# EasyEDA Pro project ProPrj_wifi-cam-car（立创eda专业版导入）.epro

# Schematic Schematic1
Board Name: Board1; Create Date: 2024-10-17; Page Name: P1; Project Name: wifi-cam-car; Schematic Name: Schematic1; Update Date: 2024-10-22; Company: 嘉立创EDA; Page Size: A3; Version: V1.0
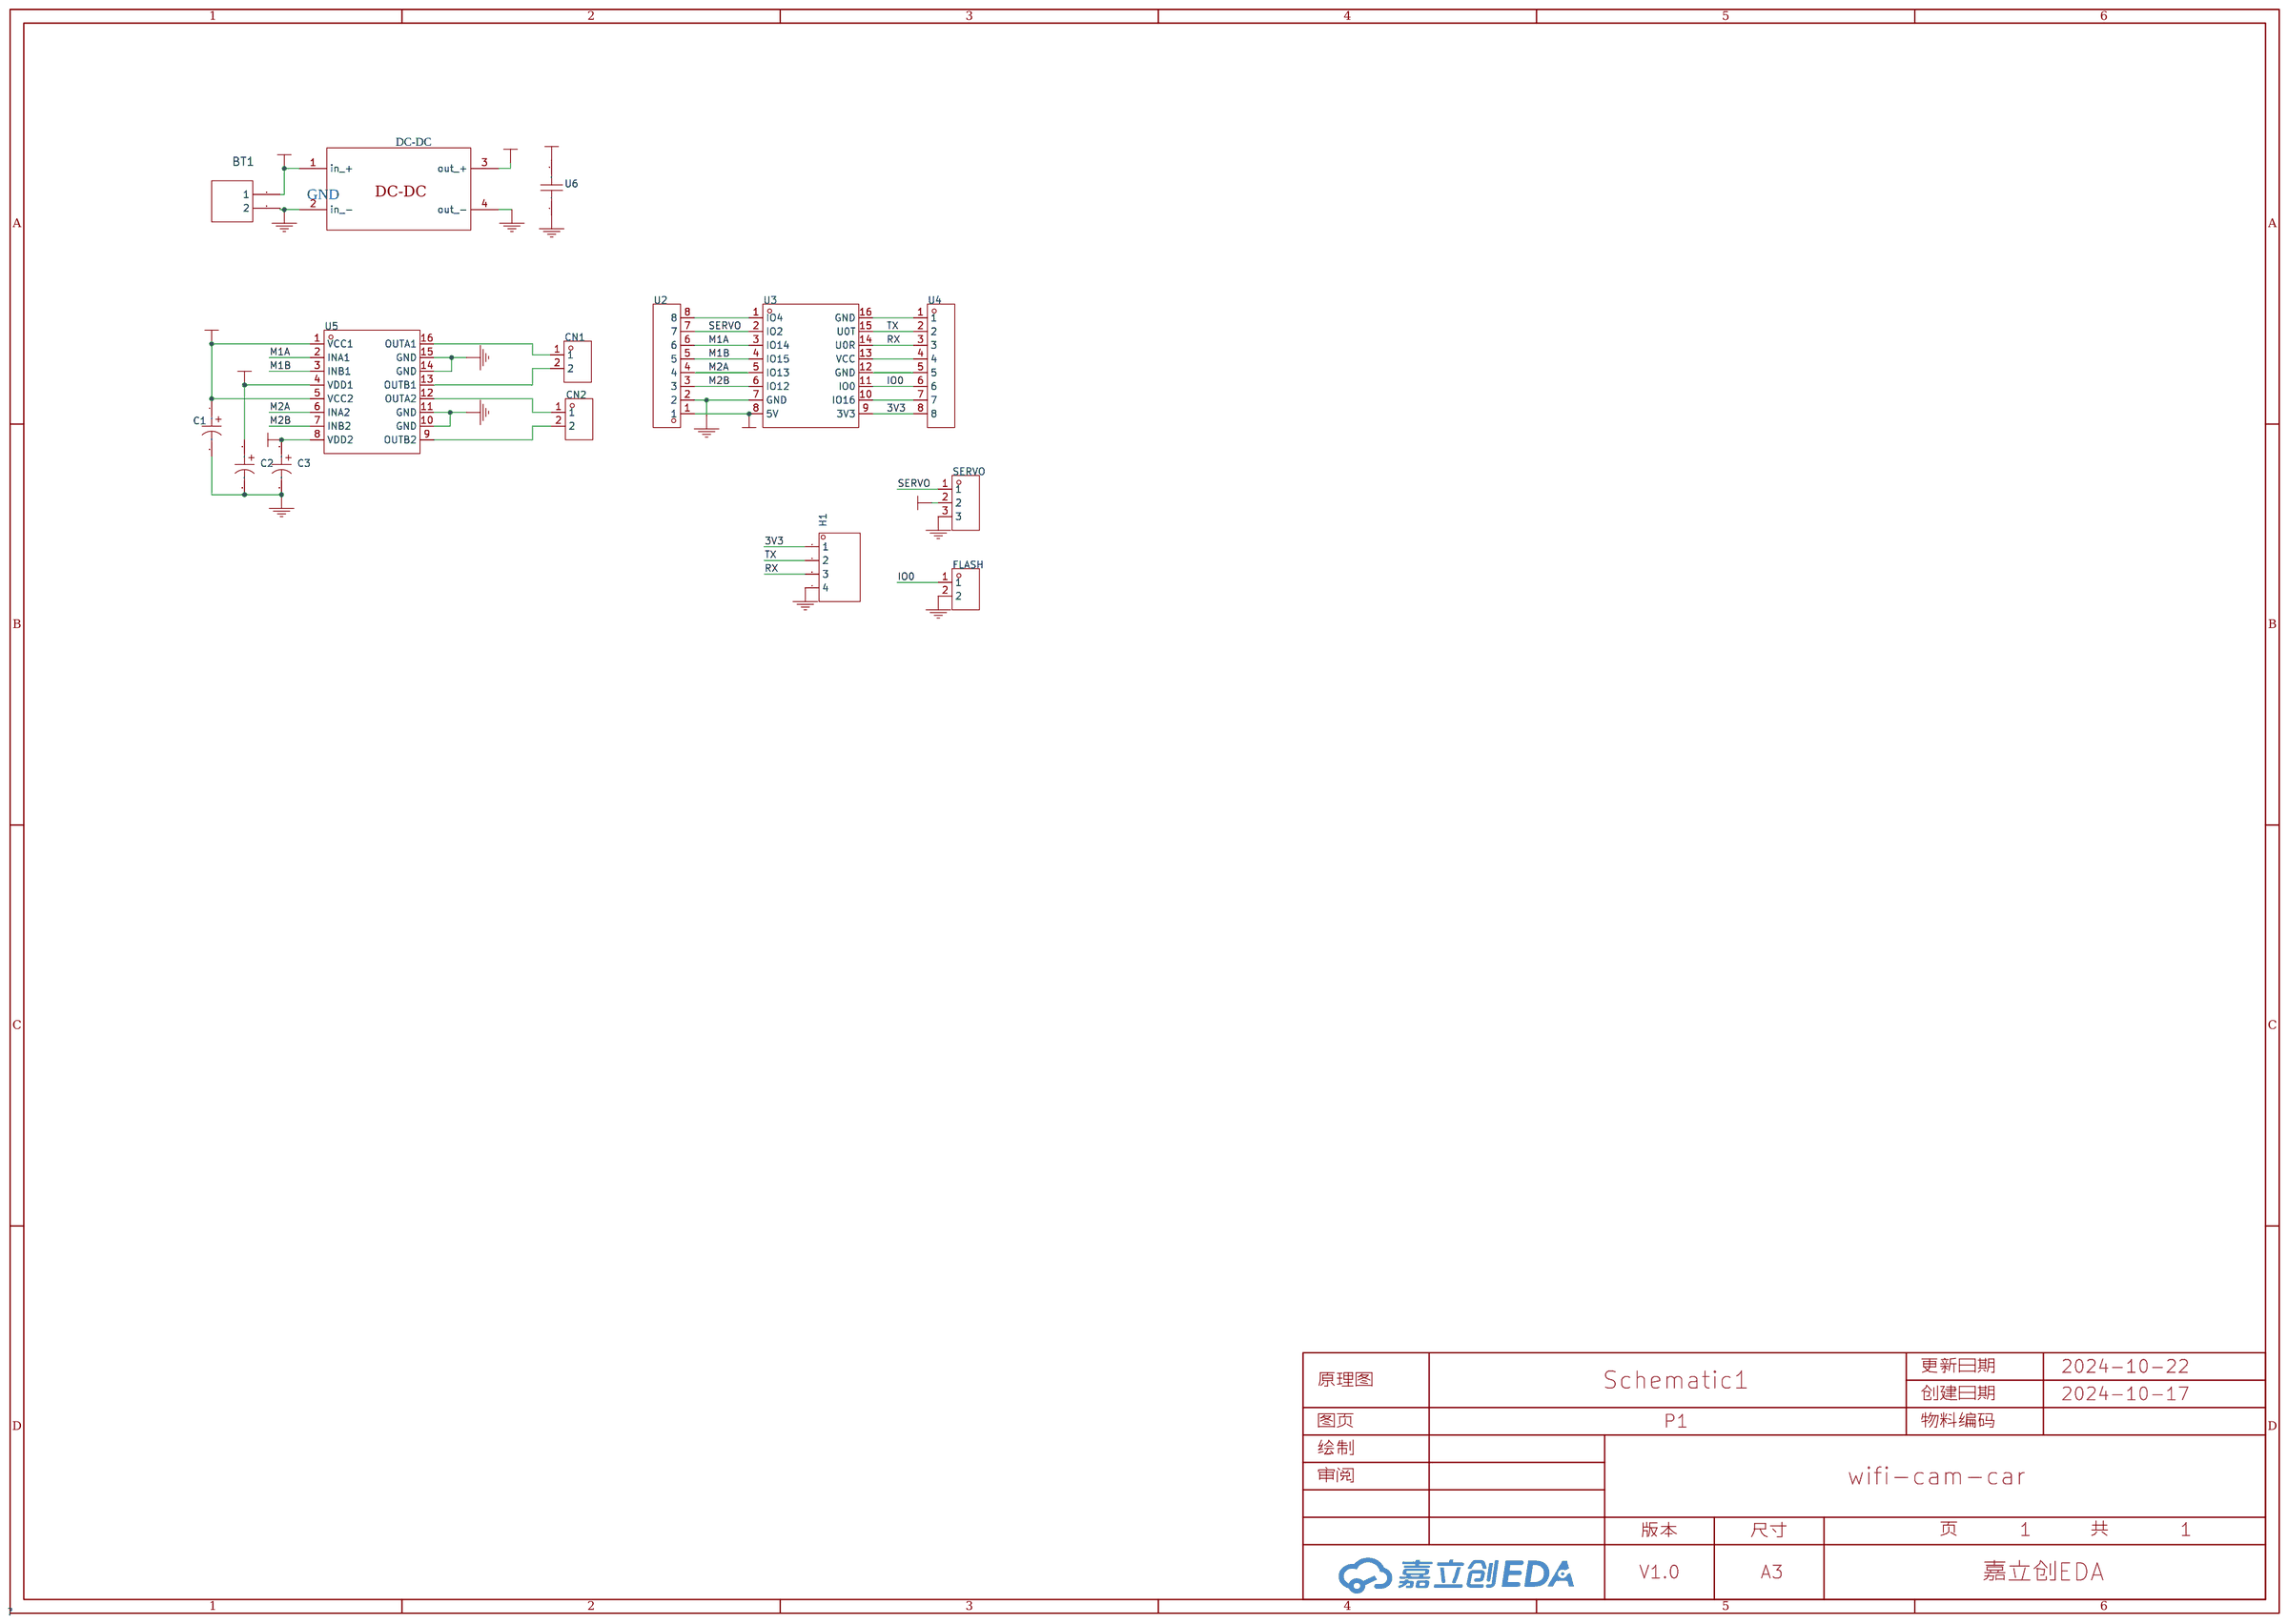
[diagram p0: schematic sheet]

## Parts
1  DC-DC  [电源模块]
BT1  SIP2  [CONN-TH_2P-P5.08_DB2EV-5.08-2P-BK]
C1  10uF  [CAP-TH_BD4.0-P1.50-D0.5-FD]
C2  100uF  [CAP-TH_BD8.0-P3.50-D0.6-FD]
C3  100uF  [CAP-TH_BD8.0-P3.50-D0.6-FD]
CN1  间距5.08MM  [CONN-TH_WJ2EDGVC-5.08-2P]
CN2  间距5.08MM  [CONN-TH_WJ2EDGVC-5.08-2P]
FLASH  -  [HDR-TH_2P-P2.54-V-M-R2-C1-S2.54]
H1  -  [HDR-TH_4P-P2.54-V-M]
SERVO  排母2.54mm 1X3pin  [HDR-TH_3P-P2.54_CS-1165SDIG]
U2  2.54mmx8  [HDR-TH_8P-P2.54-V-M-4]
U3  ESP32-CAM  [COMM-TH_16P-L40.0-W27.0-P2.54_ESP32-CAM]
U4  2.54mmx8  [HDR-TH_8P-P2.54-V-M-4]
U5  mx1616  [SOIC-16_L9.9-W3.9-P1.27-LS6.0-BL]
U6  100nF  [CAP-TH_L5.5-W2.5-P5.00-D0.50-S2.0]

## Library data of the parts
1 = DC-DC
BT1 = SIP2: Manufacturer Part: ?
C1 = EEA-FC1E100: 容值:10uF;精度:±20%;额定电压:25V;纹波电流:42.25mA@120Hz;等效串联电阻:2Ω;; LCSC Part Name: 10uF ±20% 25V; Supplier Part: C1582024; Manufacturer: PANASONIC(松下); Supplier Footprint: 插件,D4xL7mm; JLCPCB Part Class: 扩展库; Supplier: LCSC; Tolerance: ±20%; Rated Voltage: 25V; Ripple Current: 42.25mA@120Hz; Equivalent Series Resistance(ESR): 2Ω; Lead Spacing: 1.5mm; φD: 4mm; L: 7mm; Lifetime @ Temp: 1000hrs@105℃; Operating Temperature: -55℃~+105℃
C2 C3 = EPF1HM101F12OTPVZC: 容值:100uF;精度:±20%;额定电压:50V;; LCSC Part Name: 100uF ±20% 50V; Supplier Part: C22395150; Manufacturer: Yunxing(云星); Supplier Footprint: 插件,D8xL12mm; JLCPCB Part Class: 扩展库; Datasheet: https://atta.szlcsc.com/upload/public/pdf/source/20240510/4F2F890E66061B71D8704D6AF2AF283E.pdf; Supplier: LCSC; Tolerance: ±20%; Rated Voltage: 50V
CN1 CN2 = 间距5.08MM: Supplier Part: C9900021608; Supplier Footprint: 2PIN绿色直针插座; JLCPCB Part Class: 扩展库; Supplier: LCSC
FLASH = SIP2-2.54MM双排针: Pin Type: IN
H1 = 4p
SERVO = 排母2.54mm 1X3pin: Supplier Part: C9900016709; JLCPCB Part Class: 扩展库; Supplier: LCSC
U2 U4 = 2.54mmx8: Supplier Part: C9900030426; Supplier Footprint: 2.54*8P/30mm; JLCPCB Part Class: 扩展库; Supplier: LCSC
U3 = ESP32-CAM: Supplier Part: C277946; Manufacturer: Ai-Thinker(安信可); Supplier Footprint: 插件; JLCPCB Part Class: 扩展库; Datasheet: https://atta.szlcsc.com/upload/public/pdf/source/20180906/C277946_000C39242C68478A3C556AF60BF76A1F.pdf; Supplier: LCSC
U5 = mx1616: Supplier Part: C9900004755; Supplier Footprint: SOIC-16; JLCPCB Part Class: 扩展库; Supplier: LCSC
U6 = CC1H104ZC1FD3F5O1100: 容值:100nF;精度:-20%~+80%;额定电压:50V;温度系数:Y5V;; LCSC Part Name: 100nF -20%~+80% 50V; Supplier Part: C2832508; Manufacturer: Dersonic(德尔创); Supplier Footprint: 插件,P=5.08mm; JLCPCB Part Class: 扩展库; Datasheet: https://atta.szlcsc.com/upload/public/pdf/source/20211027/6BE094CC11F3C85D18CFEA066D7024CD.pdf; Supplier: LCSC; Tolerance: -20%~+80%; Voltage Rated: 50V; Lead Spacing: 5.08mm; Temperature Coefficient: Y5V; φD: 5.5mm; Body Thickness: 2.4mm

## Nets
3V3: H1.1 U3.9(3V3) U4.8
+5V: 1.3(out +) C1.1 U2.1 U3.8(5V) U5.1(VCC1) U5.5(VCC2) U6.2
GND: 1.2(in -) 1.4(out -) BT1.2 C1.2 C2.2 C3.2 FLASH.2 H1.4 SERVO.3 U2.2 U3.7(GND) U5.10(GND) U5.11(GND) U5.14(GND) U5.15(GND) U6.1
+BT: 1.1(in +) BT1.1 C2.1 C3.1 SERVO.2 U5.4(VDD1) U5.8(VDD2)
IO0: FLASH.1 U3.11(IO0) U4.6
M1A: U2.6 U3.3(IO14) U5.2(INA1)
M1B: U2.5 U3.4(IO15) U5.3(INB1)
M2A: U2.4 U3.5(IO13) U5.6(INA2)
M2B: U2.3 U3.6(IO12) U5.7(INB2)
RX: H1.3 U3.14(U0R) U4.3
SERVO: SERVO.1 U2.7 U3.2(IO2)
TX: H1.2 U3.15(U0T) U4.2
$1N1394: CN1.1 U5.16(OUTA1)
$1N1398: CN1.2 U5.13(OUTB1)
$1N1404: CN2.1 U5.12(OUTA2)
$1N1418: CN2.2 U5.9(OUTB2)
Net-(U2-8): U2.8 U3.1(IO4)
Net-(U3-10): U3.10(IO16) U4.7
Net-(U3-12): U3.12(GND) U4.5
Net-(U3-13): U3.13(VCC) U4.4
Net-(U3-16): U3.16(GND) U4.1

## Notes on the sheet
- GND

# Board PCB1
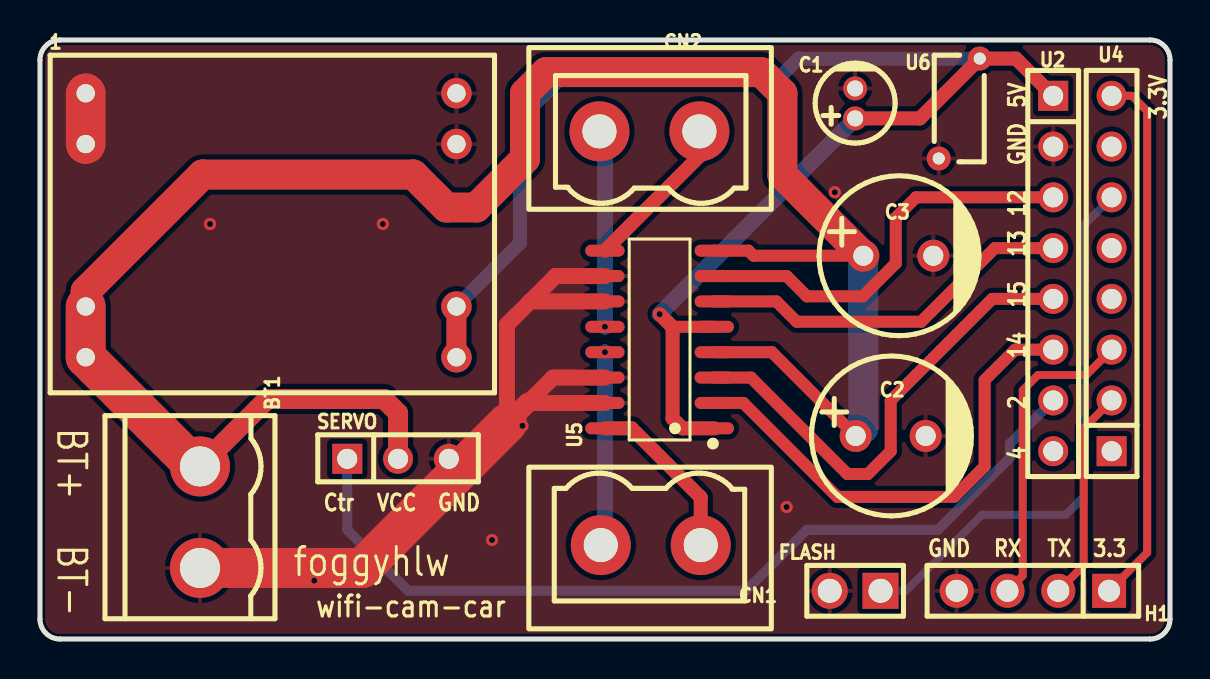
[diagram p1: board, top side]
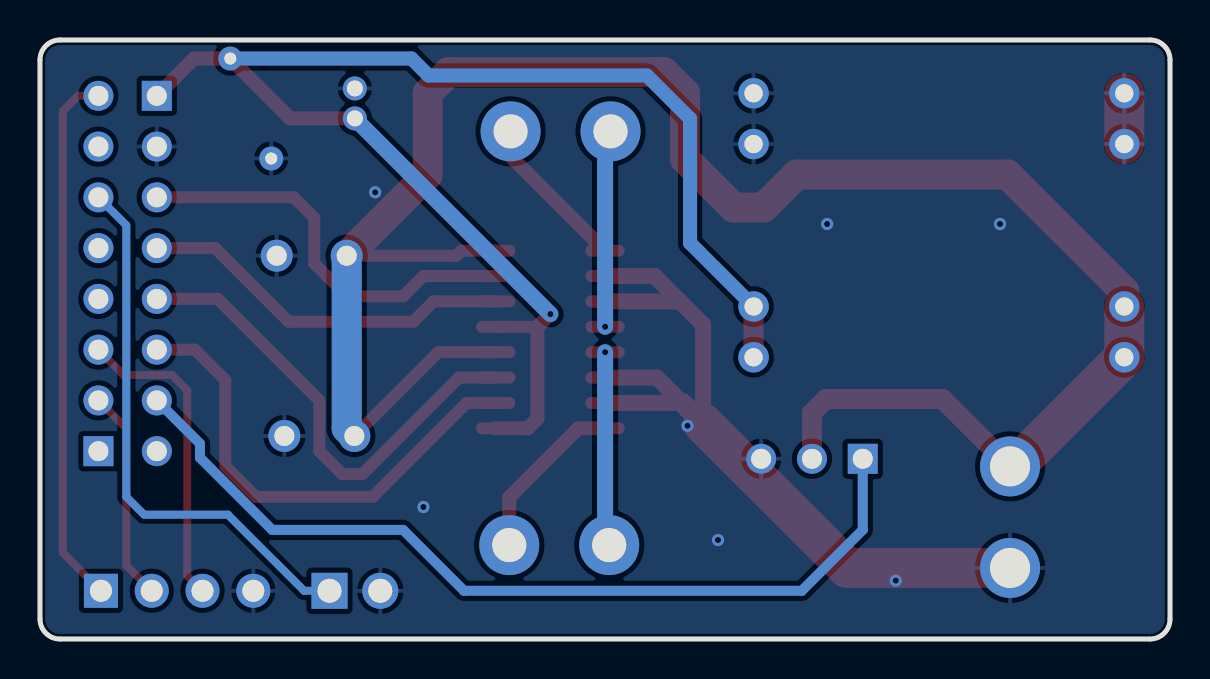
[diagram p2: board, bottom side, seen from below]

Outline 56.52 x 29.97 mm; copper layers: Top Layer, Bottom Layer. Coordinates in mm from the lower left corner of the outline.
Outline path: 0,28.97 0,1 arc(0.29,0.29) 1,0 55.52,0 arc(56.22,0.29) 56.52,1 56.52,28.97 arc(56.22,29.68) 55.52,29.97 1,29.97 arc(0.29,29.68) 0,28.97
Stack: Top Layer 0.035mm / Dielectric1 1.51mm FR4 er 4.5 / Bottom Layer 0.035mm

## Design rules (mm)
template: JLCPCB Capability(Two Layers Board)
spacing copperThickness1oz (default): track to track 0.102, other pairs 0.152 to 0.3
spacing copperThickness2oz: track to track 0.203, other pairs 0.152 to 0.3
track width copperThickness1oz (default): min 0.127, default 0.254, max 2.54
track width copperThickness2oz: min 0.203, default 0.254, max 2.54
differential pair differentialPair (default): width min 0.127, default 0.254, max 2.54; gap min 0.152, default 0.152
via viaSize (default): diameter min 0.5, default 0.61, max 10; hole min 0.3, default 0.305, max 6.3

## Placement (name value [footprint] x y rotation side)
1  DC-DC  [电源模块]  12.06 20.19 0 top
BT1  SIP2  [CONN-TH_2P-P5.08_DB2EV-5.08-2P-BK]  8 6.1 270 top
C1  10uF  [CAP-TH_BD4.0-P1.50-D0.5-FD]  40.77 26.8 90 top
C2  100uF  [CAP-TH_BD8.0-P3.50-D0.6-FD]  42.54 10.16 0 top
C3  100uF  [CAP-TH_BD8.0-P3.50-D0.6-FD]  42.93 19.18 0 top
CN1  间距5.08MM  [CONN-TH_WJ2EDGVC-5.08-2P]  30.55 4.7 180 top
CN2  间距5.08MM  [CONN-TH_WJ2EDGVC-5.08-2P]  30.48 25.4 0 top
FLASH  -  [HDR-TH_2P-P2.54-V-M-R2-C1-S2.54]  40.77 2.41 90 top
H1  -  [HDR-TH_4P-P2.54-V-M]  49.66 2.41 180 top
SERVO  排母2.54mm 1X3pin  [HDR-TH_3P-P2.54_CS-1165SDIG]  17.91 9.02 0 top
U2  2.54mmx8  [HDR-TH_8P-P2.54-V-M-4]  50.67 18.29 270 top
U4  2.54mmx8  [HDR-TH_8P-P2.54-V-M-4]  53.59 18.29 90 top
U5  mx1616  [SOIC-16_L9.9-W3.9-P1.27-LS6.0-BL]  30.99 14.99 90 top
U6  100nF  [CAP-TH_L5.5-W2.5-P5.00-D0.50-S2.0]  45.97 26.54 90 top

## Footprints (pads in the part's own frame, mm; a bottom-side part is the same pattern mirrored in y, then rotated)
CAP-TH_BD4.0-P1.50-D0.5-FD
  round 1.2 hole 0.8: 1(-0.75,0) 2(0.75,0)
CAP-TH_BD8.0-P3.50-D0.6-FD
  round 1.6 hole 1: 1(-1.75,0) 2(1.75,0)
CAP-TH_L5.5-W2.5-P5.00-D0.50-S2.0
  round 1.2 hole 0.6: 1(-2.5,1.025) 2(2.5,-1.025)
CONN-TH_2P-P5.08_DB2EV-5.08-2P-BK
  round 2.999 hole 1.999: 1(-2.54,0) 2(2.54,0)
CONN-TH_WJ2EDGVC-5.08-2P
  round 3 hole 1.7: 1(-2.499,0) 2(2.499,0)
HDR-TH_2P-P2.54-V-M-R2-C1-S2.54
  rect 1.801x1.801 hole 1.199: 1(0,-1.27)
  round 1.801 hole 1.199: 2(0,1.27)
HDR-TH_3P-P2.54_CS-1165SDIG
  rect 1.5x1.5 hole 1: 1(-2.54,0)
  round 1.5 hole 1: 2(0,0) 3(2.54,0)
HDR-TH_4P-P2.54-V-M
  rect 1.7x1.7 hole 1.1: 1(-3.81,0)
  round 1.7 hole 1.1: 2(-1.27,0) 3(1.27,0) 4(3.81,0)
HDR-TH_8P-P2.54-V-M-4
  rect 1.5x1.5 hole 1: 1(-8.89,0)
  round 1.5 hole 1: 2(-6.35,0) 3(-3.81,0) 4(-1.27,0) 5(1.27,0) 6(3.81,0) 7(6.35,0) 8(8.89,0)
SOIC-16_L9.9-W3.9-P1.27-LS6.0-BL
  oval 0.602x1.971 smd: 1(-4.445,-2.736) 2(-3.175,-2.736) 3(-1.905,-2.736) 4(-0.635,-2.736) 5(0.635,-2.736) 6(1.905,-2.736) 7(3.175,-2.736) 8(4.445,-2.736) 9(4.445,2.736) 10(3.175,2.736) 11(1.905,2.736) 12(0.635,2.736) 13(-0.635,2.736) 14(-1.905,2.736) 15(-3.175,2.736) 16(-4.445,2.736)
电源模块
  round 1.524 hole 0.914: 1(-9.779,-3.556) 1(-9.779,-6.096) 2(-9.779,7.112) 2(-9.779,4.572) 3(8.763,-3.556) 3(8.763,-6.096) 4(8.763,7.112) 4(8.763,4.572)

## Nets
As in the schematic.

## Via types
v1: diameter 0.61, hole 0.305, Top Layer to Bottom Layer, 10 vias

## Routing (per net, layer and track width the routed paths; a pad name or vN(x,y) marks a point on that pad's centre or on a via; arc(x,y) is an arc through that point)
3V3: length 26.9
  Top Layer w0.4: U4.8 54.61,27.18 55.37,26.42 55.37,4.32 H1.1
+5V: length 73.1
  Top Layer w0.6: 31.62,15.62 U5.5
  Top Layer w0.7: v1(30.99,16.26) 31.64,15.61 31.64,11.04 32.13,10.54 U5.1 ; U2.1 48.81,29.04 U6.2 44,26.05 C1.1
  Top Layer w1: 1.3 1.3
  Bottom Layer w0.7: U6.2 37.93,29.04 37.08,28.19 26.16,28.19 24,26.03 24,19.81 1.3
  Bottom Layer w0.8: C1.1 40.77,26.03 v1(30.99,16.26)
GND: length 45.2
  Top Layer w0.8: 24.51,16.89 23.35,15.73 23.35,10.78 ; 24.51,16.89 25.78,18.16 U5.10 ; 24.51,16.89 U5.11 ; U5.15 24.38,11.81 25.65,13.08 U5.14
  Top Layer w1: 23.35,10.78 24.38,11.81
  Top Layer w2: 1.2 1.2 ; 23.35,10.78 16.13,3.56 BT1.2
  vias: v1(8.5,20.76) v1(13.72,2.92) v1(17.15,20.76) v1(22.61,4.95) v1(24.13,10.67) v1(37.34,6.6) v1(39.75,22.35)
+BT: length 103.6
  Top Layer w0.6: C3.1 35.69,19.18 35.43,19.43 U5.8 ; U5.4 36.6,14.35 C2.1
  Top Layer w1: 8,8.64 11.38,12.01 17.2,12.01 17.91,11.3 SERVO.2
  Top Layer w1.5: C3.1 37.13,23.22 37.13,27.3 36.07,28.37 25.32,28.37 24.26,27.3 24.26,24.03 21.82,21.59 20.32,21.59 18.67,23.24 8.13,23.24 2.29,17.4 1.1
  Top Layer w2: 1.1 1.1 7.75,8.64 8,8.64
  Bottom Layer w1.5: C3.1 41.18,10.54 C2.1
IO0: length 27.7
  Bottom Layer w0.4: FLASH.1 43.31,2.41 47.12,6.22 51.31,6.22 52.2,7.11 52.2,20.7 U4.6
M1A: length 24.5
  Top Layer w0.6: U2.6 48.77,14.48 47.24,12.95 47.24,8.64 45.72,7.11 39.88,7.11 35.18,11.81 U5.2
M1B: length 24.1
  Top Layer w0.6: U5.3 35.56,13.08 40.39,8.25 41.4,8.25 42.54,9.4 42.54,11.94 47.62,17.02 U2.5
M2A: length 18.9
  Top Layer w0.6: U5.6 36.83,16.89 37.85,15.88 44.07,15.88 47.75,19.56 U2.4
M2B: length 20.8
  Top Layer w0.6: U5.7 37.34,18.16 38.35,17.14 41.15,17.14 42.8,18.8 42.8,21.08 43.81,22.1 U2.3
RX: length 15.6
  Top Layer w0.4: U4.3 52.32,13.21 49.91,13.21 49.15,12.45 49.15,3.17 H1.3
SERVO: length 44.5
  Bottom Layer w0.5: SERVO.1 15.37,5.46 18.41,2.41 35.31,2.41 38.35,5.46 44.9,5.46 48.51,9.07 48.51,9.78 U2.7
TX: length 10.6
  Top Layer w0.4: U4.2 52.2,10.54 52.2,3.68 H1.2
$1N1394: length 8.6
  Top Layer w0.7: CN1.1 33.05,7.09 29.59,10.54 U5.16
$1N1398: length 9.7
  Bottom Layer w0.8: CN1.2 28.25,4.9 v1(28.25,14.35)
$1N1404: length 9.9
  Bottom Layer w0.8: v1(28.25,15.62) 28.25,25.13 CN2.1
$1N1418: length 7.9
  Top Layer w0.7: CN2.2 32.98,24.16 U5.9

## Copper pours and planes (outline as drawn; the poured copper is in the pictures)
GND on Top Layer: -2.67,33.66 61.34,33.66 61.34,-5.72 -2.67,-5.72
GND on Bottom Layer: -3.05,31.88 61.85,31.88 61.85,-3.3 -3.05,-3.3

## Text on the board
Top Silkscreen Layer: Ctr | VCC | GND | RX | TX | 3.3 | 5V | 12 | 13 | 15 | 14 | 2 | 4 | 3.3V | wifi-cam-car | BT+ | BT- | foggyhlw
